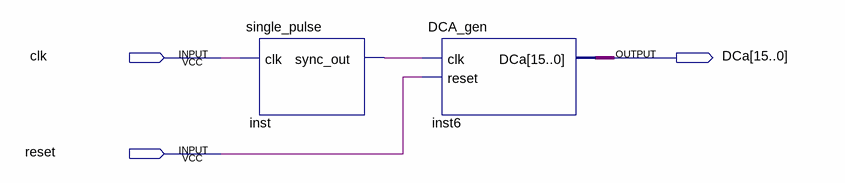
[diagram p0: schematic sheet]
// Quartus schematic clock_generator.bdf as structural Verilog: 2 symbols, 3 pins
module clock_generator (
  input  clk,
  input  reset,
  output [15:0] DCa
);

  wire inst_sync_out;

  single_pulse inst (.clk(clk), .sync_out(inst_sync_out));
  DCA_gen inst6 (.clk(inst_sync_out), .reset(reset), .DCa(DCa));
endmodule
